# EAGLE design Connector (EAGLE 6.4)
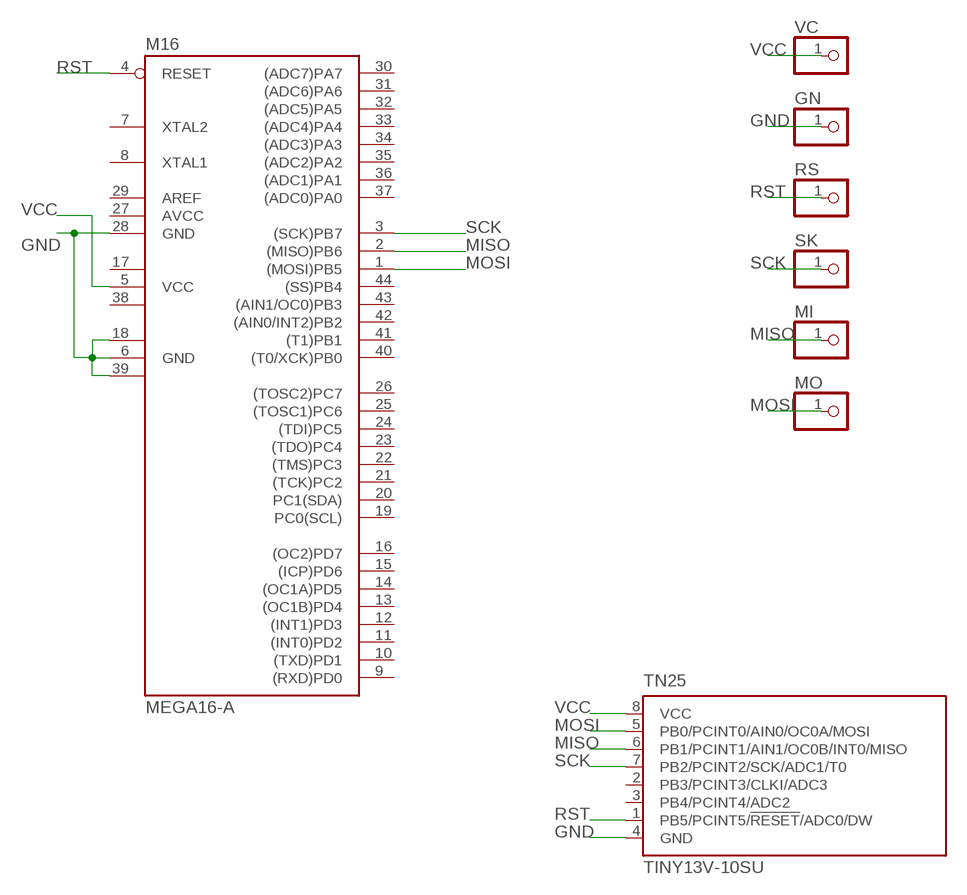
[diagram p0: schematic, sheet 1]

## Parts
GN  PINHD-1X1  [1X01]
M16  MEGA16-A  [TQFP44]
MI  PINHD-1X1  [1X01]
MO  PINHD-1X1  [1X01]
RS  PINHD-1X1  [1X01]
SK  PINHD-1X1  [1X01]
TN25  TINY13V-10SU  [8S2]
VC  PINHD-1X1  [1X01]

## Nets
GND: GN.1 M16.6(GND) M16.18(GND1) M16.28(GND) M16.39(GND2) TN25.4(GND)
MISO: M16.2((MISO)PB6) MI.1 TN25.6(PB1/PCINT1/AIN1/OC0B/INT0/MISO)
MOSI: M16.1((MOSI)PB5) MO.1 TN25.5(PB0/PCINT0/AIN0/OC0A/MOSI)
RST: M16.4(RESET) RS.1 TN25.1(PB5/PCINT5/!RESET!/ADC0/DW)
SCK: M16.3((SCK)PB7) SK.1 TN25.7(PB2/PCINT2/SCK/ADC1/T0)
VCC: M16.5(VCC) TN25.8(VCC) VC.1
Unconnected: M16.7(XTAL2) M16.8(XTAL1) M16.9((RXD)PD0) M16.10((TXD)PD1) M16.11((INT0)PD2) M16.12((INT1)PD3) M16.13((OC1B)PD4) M16.14((OC1A)PD5) M16.15((ICP)PD6) M16.16((OC2)PD7) M16.19(PC0(SCL)) M16.20(PC1(SDA)) M16.21((TCK)PC2) M16.22((TMS)PC3) M16.23((TDO)PC4) M16.24((TDI)PC5) M16.25((TOSC1)PC6) M16.26((TOSC2)PC7) M16.29(AREF) M16.30((ADC7)PA7) M16.31((ADC6)PA6) M16.32((ADC5)PA5) M16.33((ADC4)PA4) M16.34((ADC3)PA3) M16.35((ADC2)PA2) M16.36((ADC1)PA1) M16.37((ADC0)PA0) M16.40((T0/XCK)PB0) M16.41((T1)PB1) M16.42((AIN0/INT2)PB2) M16.43((AIN1/OC0)PB3) M16.44((SS)PB4) TN25.2(PB3/PCINT3/CLKI/ADC3) TN25.3(PB4/PCINT4/ADC2)

## Power pins joined to a net without a drawn wire
AVCC: M16.27(AVCC)
VCC1: M16.17(VCC1)
VCC2: M16.38(VCC2)

## Library data of the parts
GN MI MO RS SK VC = pinhead:PINHD-1X1: PIN HEADER
M16 = atmel:MEGA16: MICROCONTROLLER 16 Kbytes FLASH 1 kbytes SRAM 512 bytes EEPROM USART 8-channel 10 bit ADC Source: avr.lbr; MPN: ATMEGA16-16AU; OC_FARNELL: 9171134; OC_NEWARK: 96K6515
TN25 = atmel:TINY13: 8-bit AVR Microcontroller with 1K Bytes In-System Programmable Flash Source: http://www.atmel.com/dyn/resources/prod_documents/2535S.pdf; MPN: ATTINY13V-10SU; OC_FARNELL: 9171584; OC_NEWARK: 96K6524

## Board
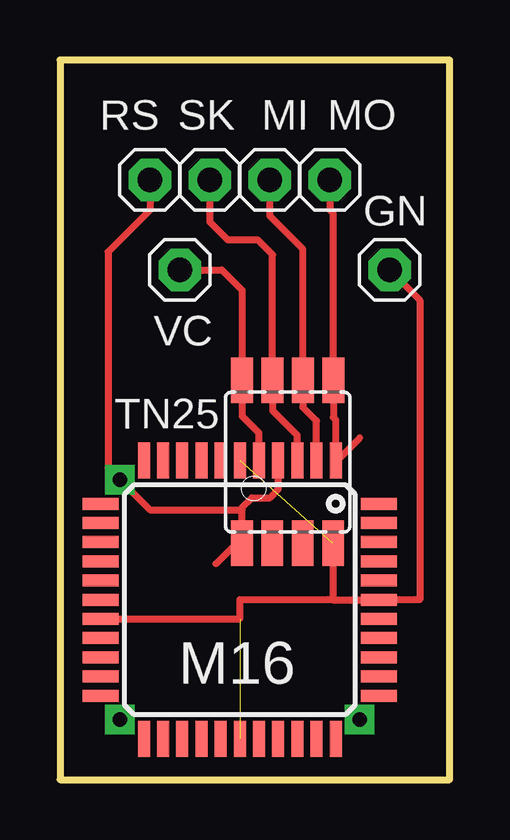
[diagram p1: board, top side]

Size 16.25 x 30 mm. Coordinates in mm from the lower left corner, seen from the top.
Outline: 0,0 16.25,0 16.25,30 0,30 0,0
Copper layers (1*16): Top 0.035mm / dielectric 1.5mm / Bottom 0.035mm
Design rules "default": minimum track width 12mil, minimum drill 20mil, track to track 12mil, track to pad 12mil, pad to pad 12mil, via to via 12mil, smd to smd 12mil, copper to edge 30mil, drill to drill 40mil, minimum pad ring 15mil, minimum via ring 12mil, stop-mask expansion 8mil, vias tented up to drill 0mil, thermal gap 10mil

### Footprints (pad centres in the part's own frame; a part is rotated, then mirrored left to right if it is on the bottom)
1X01 = drill 1.016 octagon: 1 0,0
TQFP44 = smd 1.5 x 0.5: 1 -5.8,4; 2 -5.8,3.2; 3 -5.8,2.4; 4 -5.8,1.6; 5 -5.8,0.8; 6 -5.8,0; 7 -5.8,-0.8; 8 -5.8,-1.6; 9 -5.8,-2.4; 10 -5.8,-3.2; 11 -5.8,-4; 23 5.8,-4; 24 5.8,-3.2; 25 5.8,-2.4; 26 5.8,-1.6; 27 5.8,-0.8; 28 5.8,0; 29 5.8,0.8; 30 5.8,1.6; 31 5.8,2.4; 32 5.8,3.2; 33 5.8,4 | smd 0.5 x 1.5: 12 -4,-5.8; 13 -3.2,-5.8; 14 -2.4,-5.8; 15 -1.6,-5.8; 16 -0.8,-5.8; 17 0,-5.8; 18 0.8,-5.8; 19 1.6,-5.8; 20 2.4,-5.8; 21 3.2,-5.8; 22 4,-5.8; 34 4,5.8; 35 3.2,5.8; 36 2.4,5.8; 37 1.6,5.8; 38 0.8,5.8; 39 0,5.8; 40 -0.8,5.8; 41 -1.6,5.8; 42 -2.4,5.8; 43 -3.2,5.8; 44 -4,5.8
8S2 = smd 0.9 x 1.9: 1 -1.905,-3.404; 2 -0.645,-3.404; 3 0.625,-3.404; 4 1.895,-3.404; 5 1.905,3.404; 6 0.635,3.404; 7 -0.635,3.404; 8 -1.905,3.404

### Placement (x,y rotation side)
GN  13.75,21.25 0 top
M16  7.5,7.5 270 top
MI  8.75,25 90 top
MO  11.25,25 90 top
RS  3.75,25 90 top
SK  6.25,25 90 top
TN25  9.5,13.25 0 top
VC  5,21.25 0 top

### Tracks (layer width: path | path; a pad name or v marks a point on that pad's centre or on a via)
GND  (2 unrouted)
  Top 0.3: TN25.4 11.39,7.5 | 11.39,7.5 M16.39 15,7.5 15,20 GN.1 | 11.39,7.5 7.5,7.5 7.5,6.7 M16.18
MISO
  Top 0.3: M16.2 10.7,14.95 10.13,15.52 TN25.6 10.13,22.11 8.75,23.5 MI.1
MOSI
  Top 0.3: M16.1 11.5,15 11.4,15.1 TN25.5 11.4,23.59 11.25,23.75 MO.1
N$1  (via drill 0.6)
  other vias: 2.5,2.5
N$2  (via drill 0.6)
  other vias: 12.5,2.5
N$4
  Top 0.3: 7.5,10 6.5,9
N$5
  Top 0.3: 11.5,13.25 12.5,14.25
RST  (via drill 0.6)
  Top 0.3: M16.4 9.1,12.1 8.75,11.75 8,11.75 7.59,11.35 7.59,11.25 | TN25.1 7.59,11.25 | RS.1 3.75,23.75 2,22 2,13 v2.5,12.5 3.75,11.25 7.59,11.25
SCK
  Top 0.3: M16.3 9.9,14.35 8.87,15.38 TN25.7 8.87,21.89 8.25,22.5 7,22.5 6.25,23.25 SK.1
VCC
  Top 0.3: M16.5 8.3,14.45 7.59,15.15 TN25.8 7.59,20.41 6.75,21.25 VC.1